# Altium schematic sheet Buck (24-5V).SchDoc (part 1 of 3)
size A4; SheetNumber: 2; SheetTotal: 3
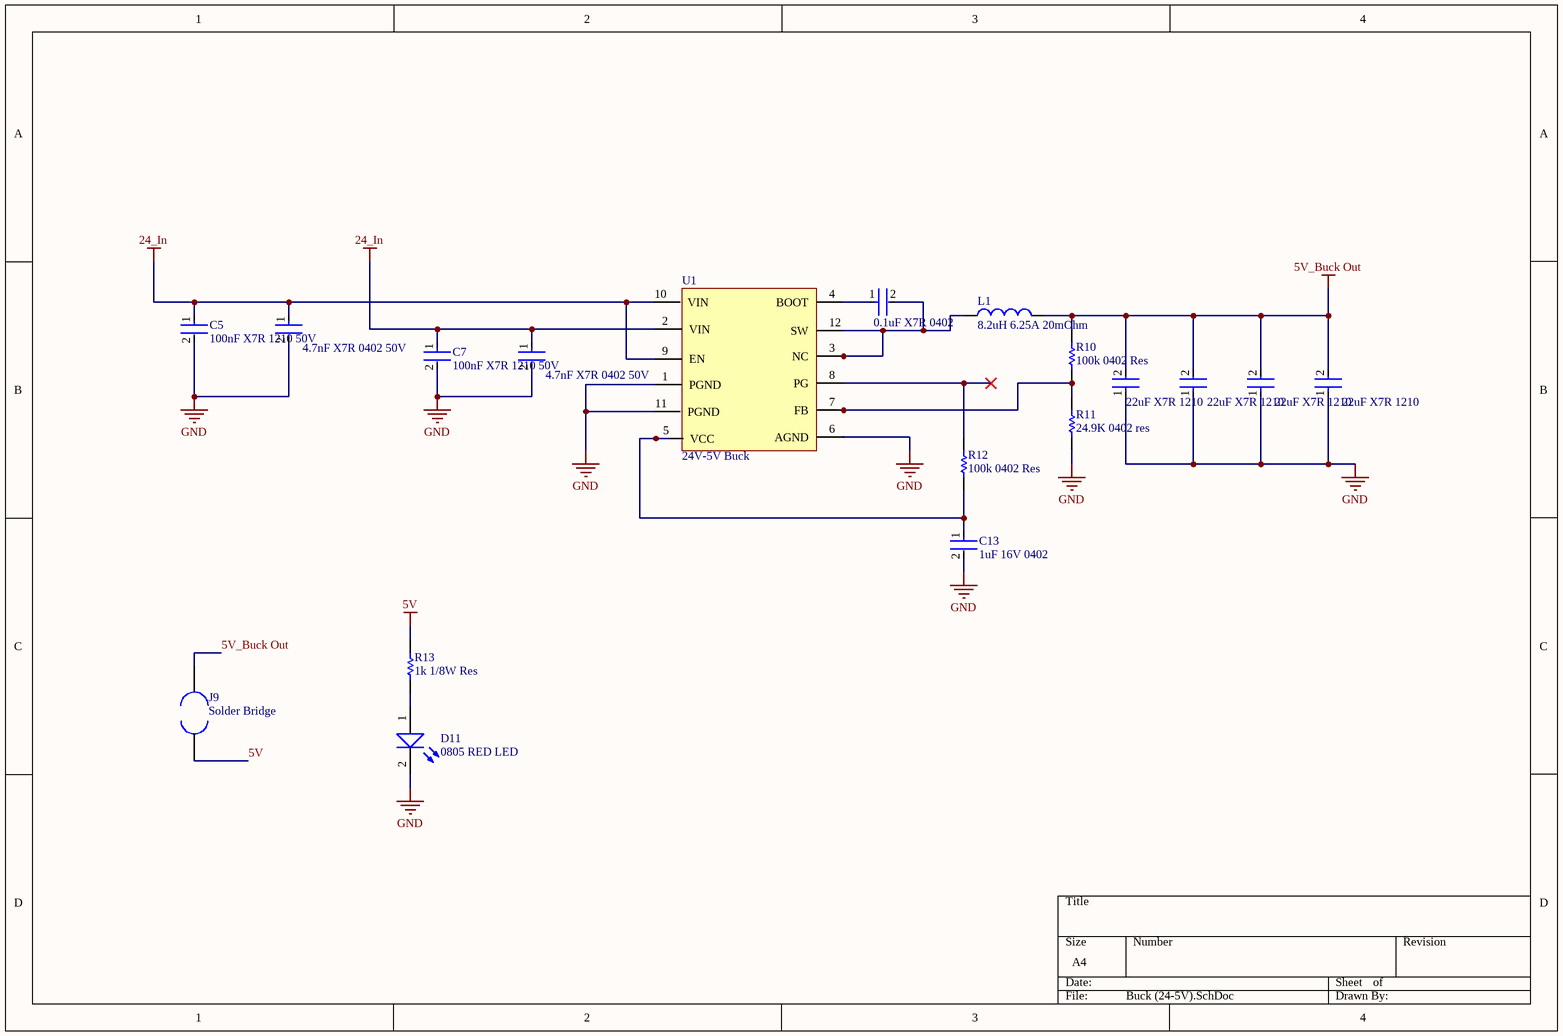
[diagram p0: Buck (24-5V).SchDoc]

## Parts
C4  0.1uF X7R 0402  [0402 capacitor]
C5  100nF X7R 1210 50V  [1210 capacitor]
C6  4.7nF X7R 0402 50V  [0402 capacitor]
C7  100nF X7R 1210 50V  [1210 capacitor]
C8  4.7nF X7R 0402 50V  [0402 capacitor]
C9  22uF X7R 1210  [1210 capacitor]
C10  22uF X7R 1210  [1210 capacitor]
C11  22uF X7R 1210  [1210 capacitor]
C12  22uF X7R 1210  [1210 capacitor]
C13  1uF 16V 0402  [0402 capacitor]
D11  0805 RED LED  [0805 LED]
J9  Solder Bridge  [1206]
L1  8.2uH 6.25A 20mOhm  [inductor]
R10  100k 0402 Res  [0402 resistor]
R11  24.9K 0402 res  [0402 resistor]
R12  100k 0402 Res  [0402 resistor]
R13  1k 1/8W Res  [0805 1K Resistor]
U1  24V-5V Buck  [buck converter]

## Nets
5V: J9.1 R13.2
5V_Buck Out: C9.2 C10.2 C11.2 C12.2 J9.2 L1.2 R10.2
24_In: C5.1 C6.1 C7.1 C8.1 U1.2(VIN) U1.9(EN) U1.10(VIN)
GND: C5.2 C6.2 C7.2 C8.2 C9.1 C10.1 C11.1 C12.1 C13.2 D11.2(K) R11.2 U1.1(PGND) U1.6(AGND) U1.11(PGND)
NetC4_1: C4.1 U1.4(BOOT)
NetC4_2: C4.2 L1.1 U1.3(NC) U1.12(SW)
NetC13_1: C13.1 R12.1 U1.5(VCC)
NetD11_1: D11.1(A) R13.1
NetR10_1: R10.1 R11.1 U1.7(FB)
NetR12_2: R12.2 U1.8(PG)